# Altium project SCMLI_Snipped.PrjPCB
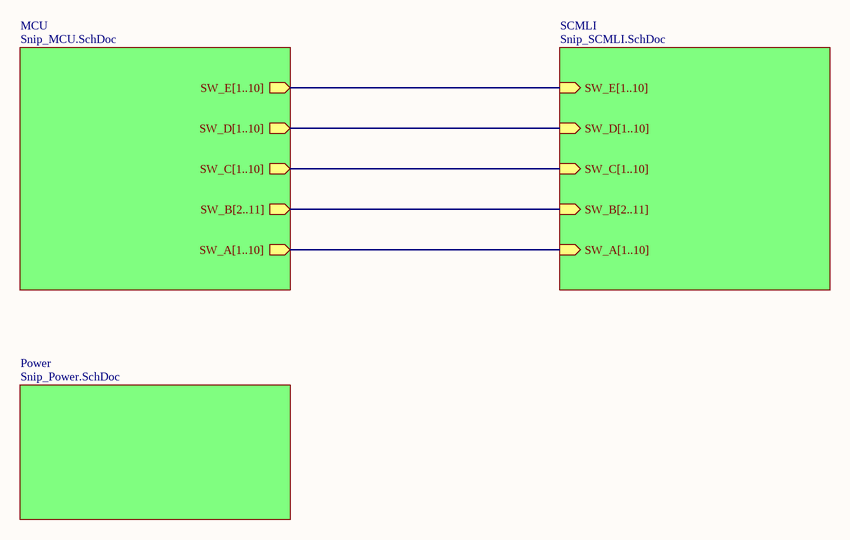
[diagram p0: Snip_Top.SchDoc]
5 sheets, 452 parts. Net scope: hierarchical (ports join the sheet entries above them; power ports are global).
Board file: SCMLI_Snipped.PcbDoc
Sheets:
  Snip_Top.SchDoc
    MCU = Snip_MCU.SchDoc
    SCMLI = Snip_SCMLI.SchDoc
      GM2 = Generic_Module.SchDoc
      GM3 = Generic_Module.SchDoc
      GM4 = Generic_Module.SchDoc
      GM5 = Generic_Module.SchDoc
      GM6 = Generic_Module.SchDoc
      GM7 = Generic_Module.SchDoc
      GM8 = Generic_Module.SchDoc
      GM9 = Generic_Module.SchDoc
      GM10 = Generic_Module.SchDoc
    Power = Snip_Power.SchDoc

## Sheet Snip_Top.SchDoc
size A

### Sub-sheets
MCU = Snip_MCU.SchDoc: SW_B[2..11] (out), SW_A[1..10] (out), SW_D[1..10] (out), SW_E[1..10] (out), SW_C[1..10] (out)
Power = Snip_Power.SchDoc: no entries
SCMLI = Snip_SCMLI.SchDoc: SW_B[2..11] (in), SW_A[1..10] (in), SW_C[1..10] (in), SW_E[1..10] (in), SW_D[1..10] (in)

### Buses and harness runs
bus sheet MCU/SW_A[1..10] = sheet SCMLI/SW_A[1..10]
bus sheet MCU/SW_B[2..11] = sheet SCMLI/SW_B[2..11]
bus sheet MCU/SW_C[1..10] = sheet SCMLI/SW_C[1..10]
bus sheet MCU/SW_D[1..10] = sheet SCMLI/SW_D[1..10]
bus sheet MCU/SW_E[1..10] = sheet SCMLI/SW_E[1..10]

## Sheet Snip_MCU.SchDoc
size C
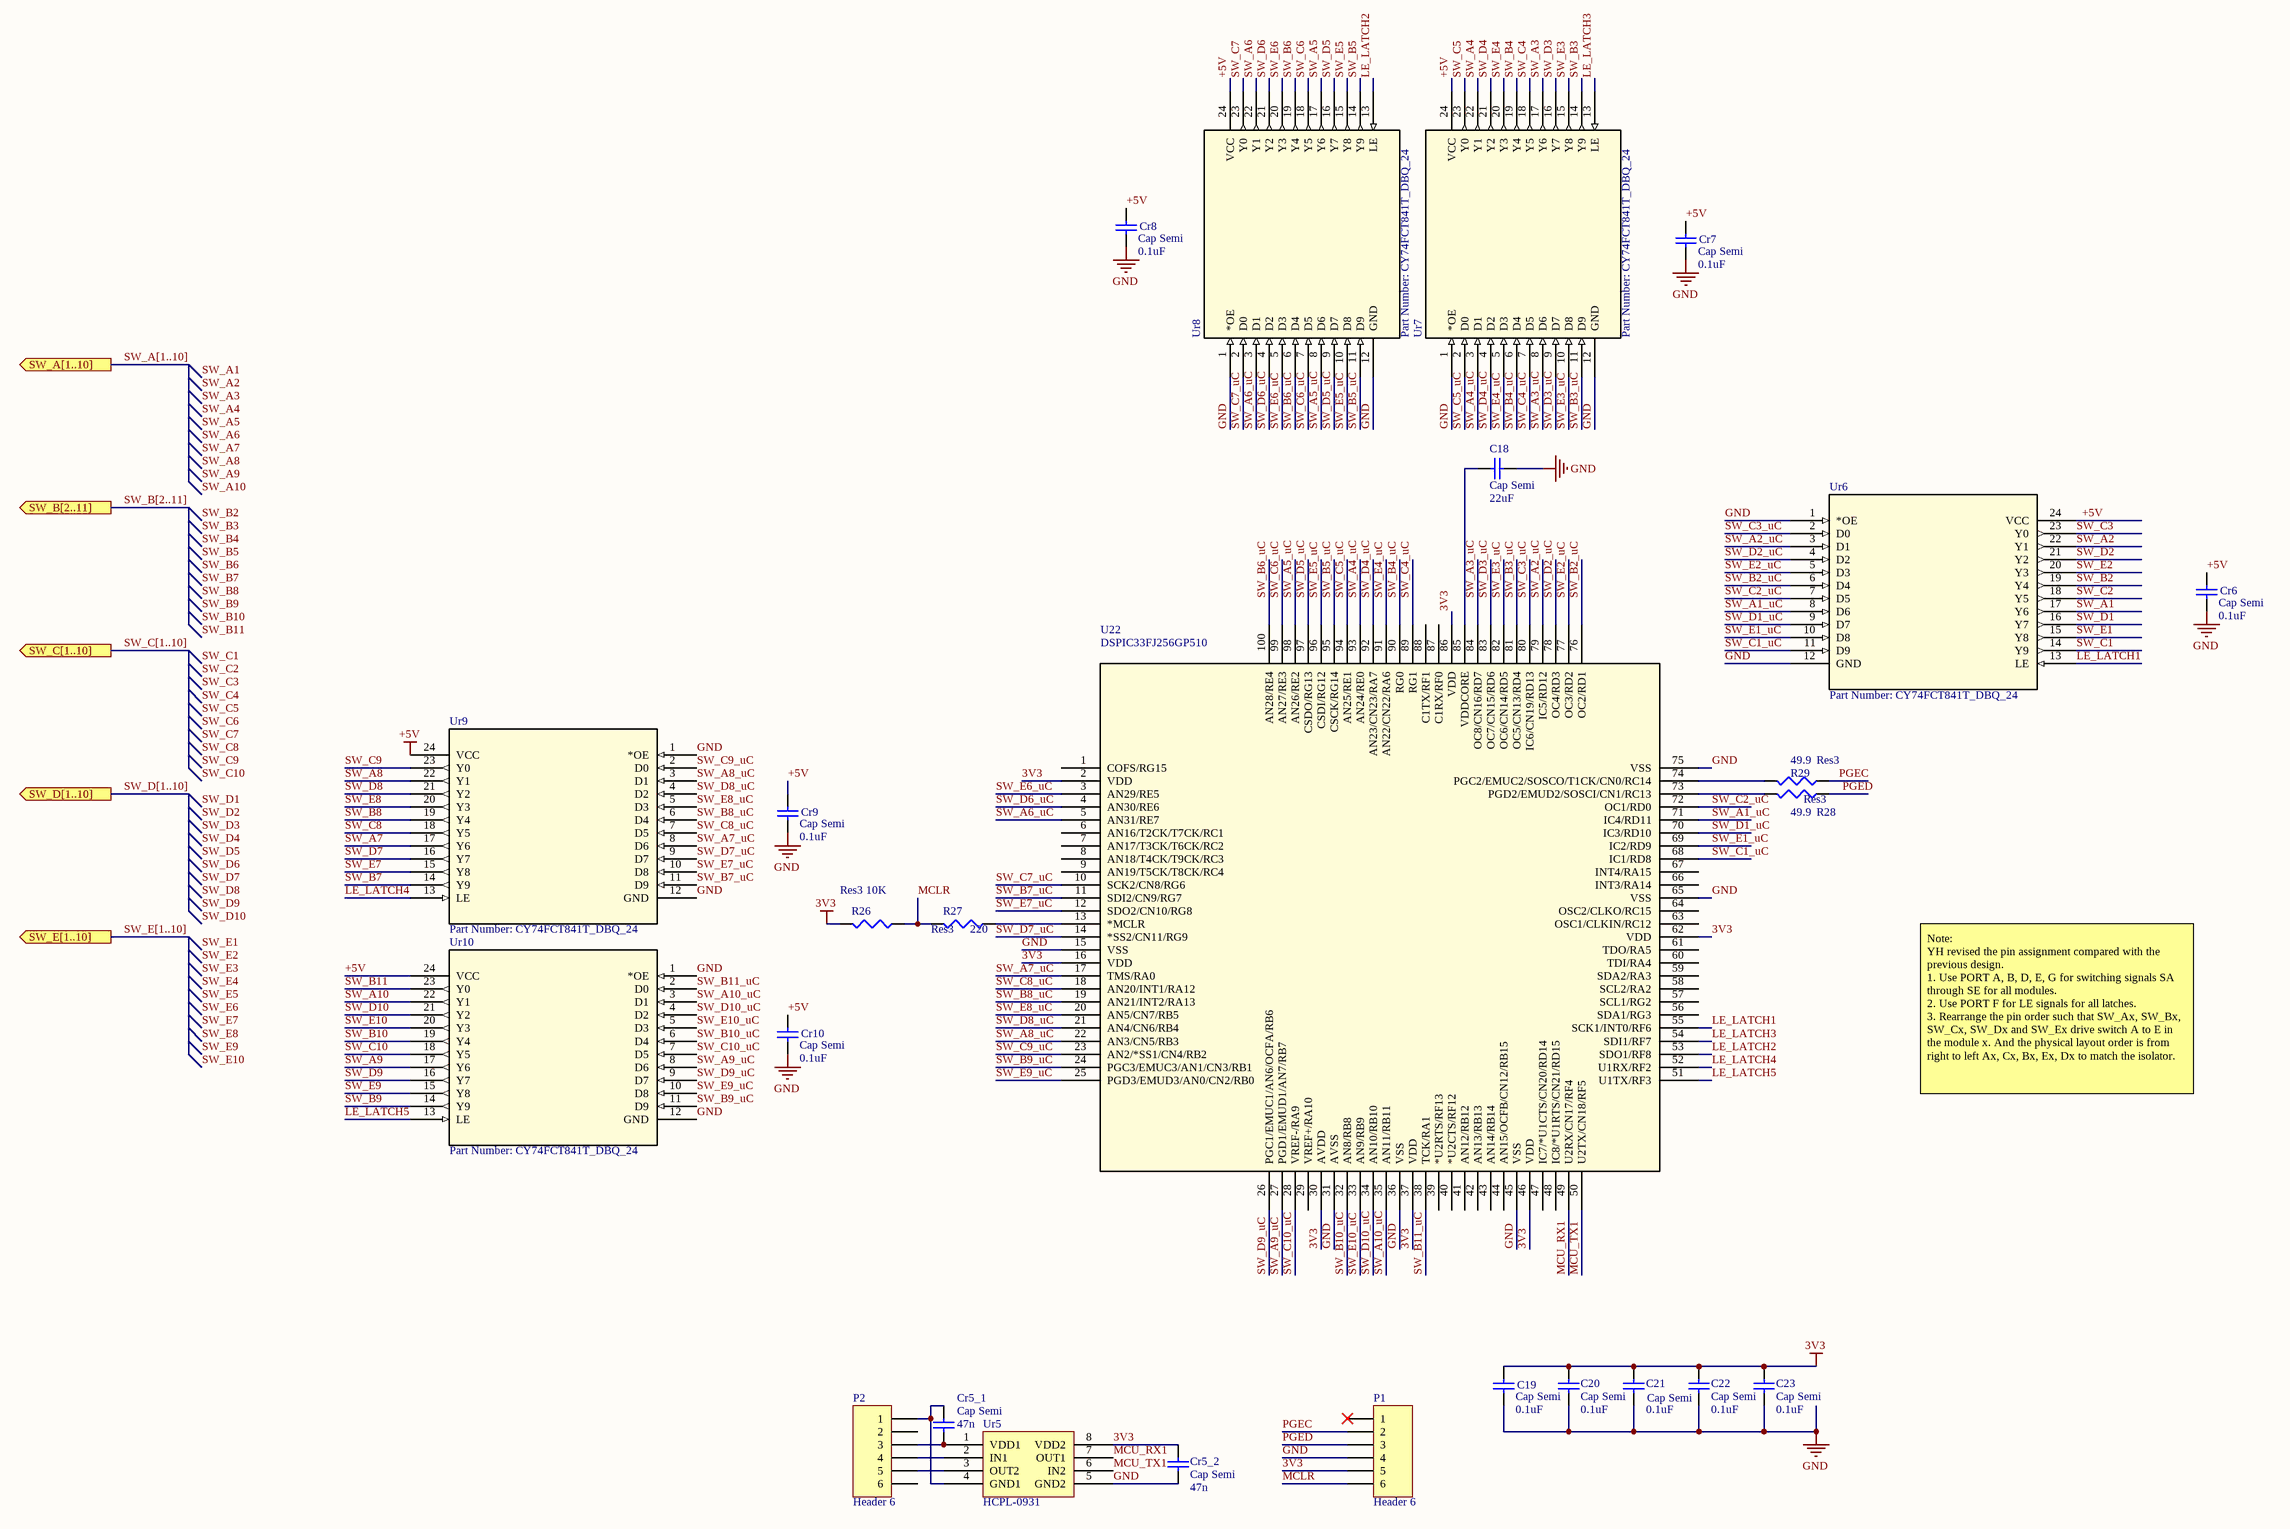
[diagram p1: Snip_MCU.SchDoc]

### Parts
C18  Cap Semi  value 22uF  [0805]
C19  Cap Semi  value 0.1uF  [1608[0603]]
C20  Cap Semi  value 0.1uF  [1608[0603]]
C21  Cap Semi  value 0.1uF  [1608[0603]]
C22  Cap Semi  value 0.1uF  [1608[0603]]
C23  Cap Semi  value 0.1uF  [1608[0603]]
Cr5_1  Cap Semi  value 47n  [C1206]
Cr5_2  Cap Semi  value 47n  [C1206]
Cr6  Cap Semi  value 0.1uF  [1608[0603]]
Cr7  Cap Semi  value 0.1uF  [1608[0603]]
Cr8  Cap Semi  value 0.1uF  [1608[0603]]
Cr9  Cap Semi  value 0.1uF  [1608[0603]]
Cr10  Cap Semi  value 0.1uF  [1608[0603]]
P1  Header 6  [HDR1X6]
P2  Header 6  [HDR1X6]
R26  Res3  value 10K  [J1-0603]
R27  Res3  value 220  [J1-0603]
R28  Res3  value 49.9  [J1-0603]
R29  Res3  value 49.9  [J1-0603]
U22  DSPIC33FJ256GP510  [TQFP100_12x12MC-]
Ur5  HCPL-0931  [SOIC-8]
Ur6  Part Number: CY74FCT841T_DBQ_24  [DBQ24]
Ur7  Part Number: CY74FCT841T_DBQ_24  [DBQ24]
Ur8  Part Number: CY74FCT841T_DBQ_24  [DBQ24]
Ur9  Part Number: CY74FCT841T_DBQ_24  [DBQ24]
Ur10  Part Number: CY74FCT841T_DBQ_24  [DBQ24]

### Ports
SW_A[1..10] (out), SW_B[2..11] (out), SW_C[1..10] (out), SW_D[1..10] (out), SW_E[1..10] (out)

### Nets
3V3: C19.2 C20.2 C21.2 C22.2 C23.2 Cr5_2.2 P1.5 R26.2 U22.2(VDD) U22.16(VDD) U22.30(AVDD) U22.37(VDD) U22.46(VDD) U22.62(VDD) U22.86(VDD) Ur5.8(VDD2)
+5V: Cr6.2 Cr7.2 Cr8.2 Cr9.2 Cr10.2 Ur6.24(VCC) Ur7.24(VCC) Ur8.24(VCC) Ur9.24(VCC) Ur10.24(VCC)
GND: C18.2 C19.1 C20.1 C21.1 C22.1 C23.1 Cr5_2.1 Cr6.1 Cr7.1 Cr8.1 Cr9.1 Cr10.1 P1.4 U22.15(VSS) U22.31(AVSS) U22.36(VSS) U22.45(VSS) U22.65(VSS) U22.75(VSS) Ur5.5(GND2) Ur6.1(*OE) Ur6.12(GND) Ur7.1(*OE) Ur7.12(GND) Ur8.1(*OE) Ur8.12(GND) Ur9.1(*OE) Ur9.12(GND) Ur10.1(*OE) Ur10.12(GND)
LE_LATCH1: U22.55(SCK1/INT0/RF6) Ur6.13(LE)
LE_LATCH2: U22.53(SDO1/RF8) Ur8.13(LE)
LE_LATCH3: U22.54(SDI1/RF7) Ur7.13(LE)
LE_LATCH4: U22.52(U1RX/RF2) Ur9.13(LE)
LE_LATCH5: U22.51(U1TX/RF3) Ur10.13(LE)
MCLR: P1.6 R26.1 R27.2
MCU_RX1: U22.49(U2RX/CN17/RF4) Ur5.7(OUT1)
MCU_TX1: U22.50(U2TX/CN18/RF5) Ur5.6(IN2)
PGEC: P1.2 R29.1
PGED: P1.3 R28.1
SW_A1: Ur6.17(Y6)
SW_A1_uC: U22.71(IC4/RD11) Ur6.8(D6)
SW_A2: Ur6.22(Y1)  [project net SW_A]
SW_A2_uC: U22.79(IC5/RD12) Ur6.3(D1)
SW_A3: Ur7.17(Y6)  [project net SW_A]
SW_A3_uC: U22.84(OC8/CN16/RD7) Ur7.8(D6)
SW_A4: Ur7.22(Y1)  [project net SW_A]
SW_A4_uC: U22.93(AN24/RE0) Ur7.3(D1)
SW_A5: Ur8.17(Y6)  [project net SW_A]
SW_A5_uC: U22.98(AN26/RE2) Ur8.8(D6)
SW_A6: Ur8.22(Y1)  [project net SW_A]
SW_A6_uC: U22.5(AN31/RE7) Ur8.3(D1)
SW_A7: Ur9.17(Y6)  [project net SW_A]
SW_A7_uC: U22.17(TMS/RA0) Ur9.8(D6)
SW_A8: Ur9.22(Y1)  [project net SW_A]
SW_A8_uC: U22.22(AN3/CN5/RB3) Ur9.3(D1)
SW_A9: Ur10.17(Y6)  [project net SW_A]
SW_A9_uC: U22.27(PGD1/EMUD1/AN7/RB7) Ur10.8(D6)
SW_A10: Ur10.22(Y1)  [project net SW_A]
SW_A10_uC: U22.35(AN11/RB11) Ur10.3(D1)
SW_B2: Ur6.19(Y4)  [project net SW_B]
SW_B2_uC: U22.76(OC2/RD1) Ur6.6(D4)
SW_B3: Ur7.14(Y9)  [project net SW_B]
SW_B3_uC: U22.81(OC5/CN13/RD4) Ur7.11(D9)
SW_B4: Ur7.19(Y4)  [project net SW_B]
SW_B4_uC: U22.90(RG0) Ur7.6(D4)
SW_B5: Ur8.14(Y9)  [project net SW_B]
SW_B5_uC: U22.95(CSCK/RG14) Ur8.11(D9)
SW_B6: Ur8.19(Y4)  [project net SW_B]
SW_B6_uC: U22.100(AN28/RE4) Ur8.6(D4)
SW_B7: Ur9.14(Y9)  [project net SW_B]
SW_B7_uC: U22.11(SDI2/CN9/RG7) Ur9.11(D9)
SW_B8: Ur9.19(Y4)  [project net SW_B]
SW_B8_uC: U22.19(AN21/INT2/RA13) Ur9.6(D4)
SW_B9: Ur10.14(Y9)  [project net SW_B]
SW_B9_uC: U22.24(PGC3/EMUC3/AN1/CN3/RB1) Ur10.11(D9)
SW_B10: Ur10.19(Y4)  [project net SW_B]
SW_B10_uC: U22.32(AN8/RB8) Ur10.6(D4)
SW_B11: Ur10.23(Y0)
SW_B11_uC: U22.38(TCK/RA1) Ur10.2(D0)
SW_C1: Ur6.14(Y9)
SW_C1_uC: U22.68(IC1/RD8) Ur6.11(D9)
SW_C2: Ur6.18(Y5)  [project net SW_C]
SW_C2_uC: U22.72(OC1/RD0) Ur6.7(D5)
SW_C3: Ur6.23(Y0)  [project net SW_C]
SW_C3_uC: U22.80(IC6/CN19/RD13) Ur6.2(D0)
SW_C4: Ur7.18(Y5)  [project net SW_C]
SW_C4_uC: U22.89(RG1) Ur7.7(D5)
SW_C5: Ur7.23(Y0)  [project net SW_C]
SW_C5_uC: U22.94(AN25/RE1) Ur7.2(D0)
SW_C6: Ur8.18(Y5)  [project net SW_C]
SW_C6_uC: U22.99(AN27/RE3) Ur8.7(D5)
SW_C7: Ur8.23(Y0)  [project net SW_C]
SW_C7_uC: U22.10(SCK2/CN8/RG6) Ur8.2(D0)
SW_C8: Ur9.18(Y5)  [project net SW_C]
SW_C8_uC: U22.18(AN20/INT1/RA12) Ur9.7(D5)
SW_C9: Ur9.23(Y0)  [project net SW_C]
SW_C9_uC: U22.23(AN2/*SS1/CN4/RB2) Ur9.2(D0)
SW_C10: Ur10.18(Y5)  [project net SW_C]
SW_C10_uC: U22.28(VREF-/RA9) Ur10.7(D5)
SW_D1: Ur6.16(Y7)
SW_D1_uC: U22.70(IC3/RD10) Ur6.9(D7)
SW_D2: Ur6.21(Y2)  [project net SW_D]
SW_D2_uC: U22.78(OC4/RD3) Ur6.4(D2)
SW_D3: Ur7.16(Y7)  [project net SW_D]
SW_D3_uC: U22.83(OC7/CN15/RD6) Ur7.9(D7)
SW_D4: Ur7.21(Y2)  [project net SW_D]
SW_D4_uC: U22.92(AN23/CN23/RA7) Ur7.4(D2)
SW_D5: Ur8.16(Y7)  [project net SW_D]
SW_D5_uC: U22.97(CSDO/RG13) Ur8.9(D7)
SW_D6: Ur8.21(Y2)  [project net SW_D]
SW_D6_uC: U22.4(AN30/RE6) Ur8.4(D2)
SW_D7: Ur9.16(Y7)  [project net SW_D]
SW_D7_uC: U22.14(*SS2/CN11/RG9) Ur9.9(D7)
SW_D8: Ur9.21(Y2)  [project net SW_D]
SW_D8_uC: U22.21(AN4/CN6/RB4) Ur9.4(D2)
SW_D9: Ur10.16(Y7)  [project net SW_D]
SW_D9_uC: U22.26(PGC1/EMUC1/AN6/OCFA/RB6) Ur10.9(D7)
SW_D10: Ur10.21(Y2)  [project net SW_D]
SW_D10_uC: U22.34(AN10/RB10) Ur10.4(D2)
SW_E1: Ur6.15(Y8)
SW_E1_uC: U22.69(IC2/RD9) Ur6.10(D8)
SW_E2: Ur6.20(Y3)  [project net SW_E]
SW_E2_uC: U22.77(OC3/RD2) Ur6.5(D3)
SW_E3: Ur7.15(Y8)  [project net SW_E]
SW_E3_uC: U22.82(OC6/CN14/RD5) Ur7.10(D8)
SW_E4: Ur7.20(Y3)  [project net SW_E]
SW_E4_uC: U22.91(AN22/CN22/RA6) Ur7.5(D3)
SW_E5: Ur8.15(Y8)  [project net SW_E]
SW_E5_uC: U22.96(CSDI/RG12) Ur8.10(D8)
SW_E6: Ur8.20(Y3)  [project net SW_E]
SW_E6_uC: U22.3(AN29/RE5) Ur8.5(D3)
SW_E7: Ur9.15(Y8)  [project net SW_E]
SW_E7_uC: U22.12(SDO2/CN10/RG8) Ur9.10(D8)
SW_E8: Ur9.20(Y3)  [project net SW_E]
SW_E8_uC: U22.20(AN5/CN7/RB5) Ur9.5(D3)
SW_E9: Ur10.15(Y8)  [project net SW_E]
SW_E9_uC: U22.25(PGD3/EMUD3/AN0/CN2/RB0) Ur10.10(D8)
SW_E10: Ur10.20(Y3)  [project net SW_E]
SW_E10_uC: U22.33(AN9/RB9) Ur10.5(D3)
NetC18_1: C18.1 U22.85(VDDCORE)
NetCr5_1_1: Cr5_1.1 P2.3 Ur5.1(VDD1)
NetCr5_1_2: Cr5_1.2 P2.1 Ur5.4(GND1)
NetP2_4: P2.4 Ur5.2(IN1)
NetP2_5: P2.5 Ur5.3(OUT2)
NetR27_1: R27.1 U22.13(*MCLR)
NetR28_2: R28.2 U22.73(PGD2/EMUD2/SOSCI/CN1/RC13)
NetR29_2: R29.2 U22.74(PGC2/EMUC2/SOSCO/T1CK/CN0/RC14)

Not connected (* = marked no-connect by the designer): P1 1*; P2 2 6; U22 1(COFS/RG15) 6(AN16/T2CK/T7CK/RC1) 7(AN17/T3CK/T6CK/RC2) 8(AN18/T4CK/T9CK/RC3) 9(AN19/T5CK/T8CK/RC4) 29(VREF+/RA10) 39(*U2RTS/RF13) 40(*U2CTS/RF12) 41(AN12/RB12) 42(AN13/RB13) 43(AN14/RB14) 44(AN15/OCFB/CN12/RB15) 47(IC7/*U1CTS/CN20/RD14) 48(IC8/*U1RTS/CN21/RD15) 56(SDA1/RG3) 57(SCL1/RG2) 58(SCL2/RA2) 59(SDA2/RA3) 60(TDI/RA4) 61(TDO/RA5) 63(OSC1/CLKIN/RC12) 64(OSC2/CLKO/RC15) 66(INT3/RA14) 67(INT4/RA15) 87(C1RX/RF0) 88(C1TX/RF1)

### Buses and harness runs
bus SW_A[1..10] = port SW_A[1..10]
bus SW_B[2..11] = port SW_B[2..11]
bus SW_C[1..10] = port SW_C[1..10]
bus SW_D[1..10] = port SW_D[1..10]
bus SW_E[1..10] = port SW_E[1..10]

### Notes on the sheet
- Note:
  YH revised the pin assignment compared with the previous design.
  1. Use PORT A, B, D, E, G for switching signals SA through SE for all modules.
  2. Use PORT F for LE signals for all latches.
  3. Rearrange the pin order such that SW_Ax, SW_Bx, SW_Cx, SW_Dx and SW_Ex drive switch A to E in the module x. And the physical layout order is from right to left Ax, Cx, Bx, Ex, Dx to match the isolator.
- Labels drawn without touching a wire or pin: SW_A1, SW_A2, SW_A3, SW_A4, SW_A5, SW_A6, SW_A7, SW_A8, SW_A9, SW_A10, SW_B2, SW_B3, SW_B4, SW_B5, SW_B6, SW_B7, SW_B8, SW_B9, SW_B10, SW_B11, SW_C1, SW_C2, SW_C3, SW_C4, SW_C5, SW_C6, SW_C7, SW_C8, SW_C9, SW_C10, SW_D1, SW_D2, SW_D3, SW_D4, SW_D5, SW_D6, SW_D7, SW_D8, SW_D9, SW_D10, SW_E1, SW_E2, SW_E3, SW_E4, SW_E5, SW_E6, SW_E7, SW_E8, SW_E9, SW_E10

### Library data of the parts
C18-C23 Cr5_1 Cr5_2 Cr6-Cr10 = Cap Semi: Capacitor (Semiconductor SIM Model); Published: 8-Jun-2000; LatestRevisionDate: 29-May-2009; LatestRevisionNote: IPC-7351 Footprint Added.; PackageReference: C1206; Publisher: Altium Limited; PackageDescription: Chip Capacitor
P1 P2 = Header 6: Header, 6-Pin; LatestRevisionDate: 17-Jul-2002; LatestRevisionNote: Re-released for DXP Platform.; Publisher: Altium Limited
R26-R29 = Res3: Resistor; Published: 8-Jun-2000; LatestRevisionDate: 29-May-2009; LatestRevisionNote: IPC-7351 Footprint Added.; PackageReference: J1-0603; Publisher: Altium Limited; PackageDescription: Chip Resistor
U22 = DSPIC33FJ256GP510: No Description Available; Copyright: Copyright (C) 2018 Accelerated Designs. All rights reserved; RefDes: RefDes; Type: DEV; Value: Value
Ur6-Ur10 = CY74FCT841T_DBQ_: 10-Bit Bus-Interface D-Type Latches with 3-State Outputs; Manufacturer: Texas Instruments; INDUSTRY_STD_PKG_TYPE: SSOP/QSOP; PIN_COUNT: 24; PACKAGE_DESIGNATOR: DBQ; Datasheet_URL: http://www.ti.com/lit/gpn/CY74FCT841T; FAMILY_NAME: D-TYPE LATCH; GENERIC_PART_NUMBER: CY74FCT841T; Vendor: Texas Instruments; Manufacturer_Part_Number: CY74FCT841T_DBQ_24; Copyright: Copyright (C) 2018 Accelerated Designs. All rights reserved; RefDes: RefDes; Type: DEV; Value: Value
Ur5 = HCPL-0931: ComponentLink: http://www.digikey.com/product-detail/en/broadcom-limited/HCPL-0931/516-2702-5-ND/969355

## Sheet Snip_SCMLI.SchDoc
size D
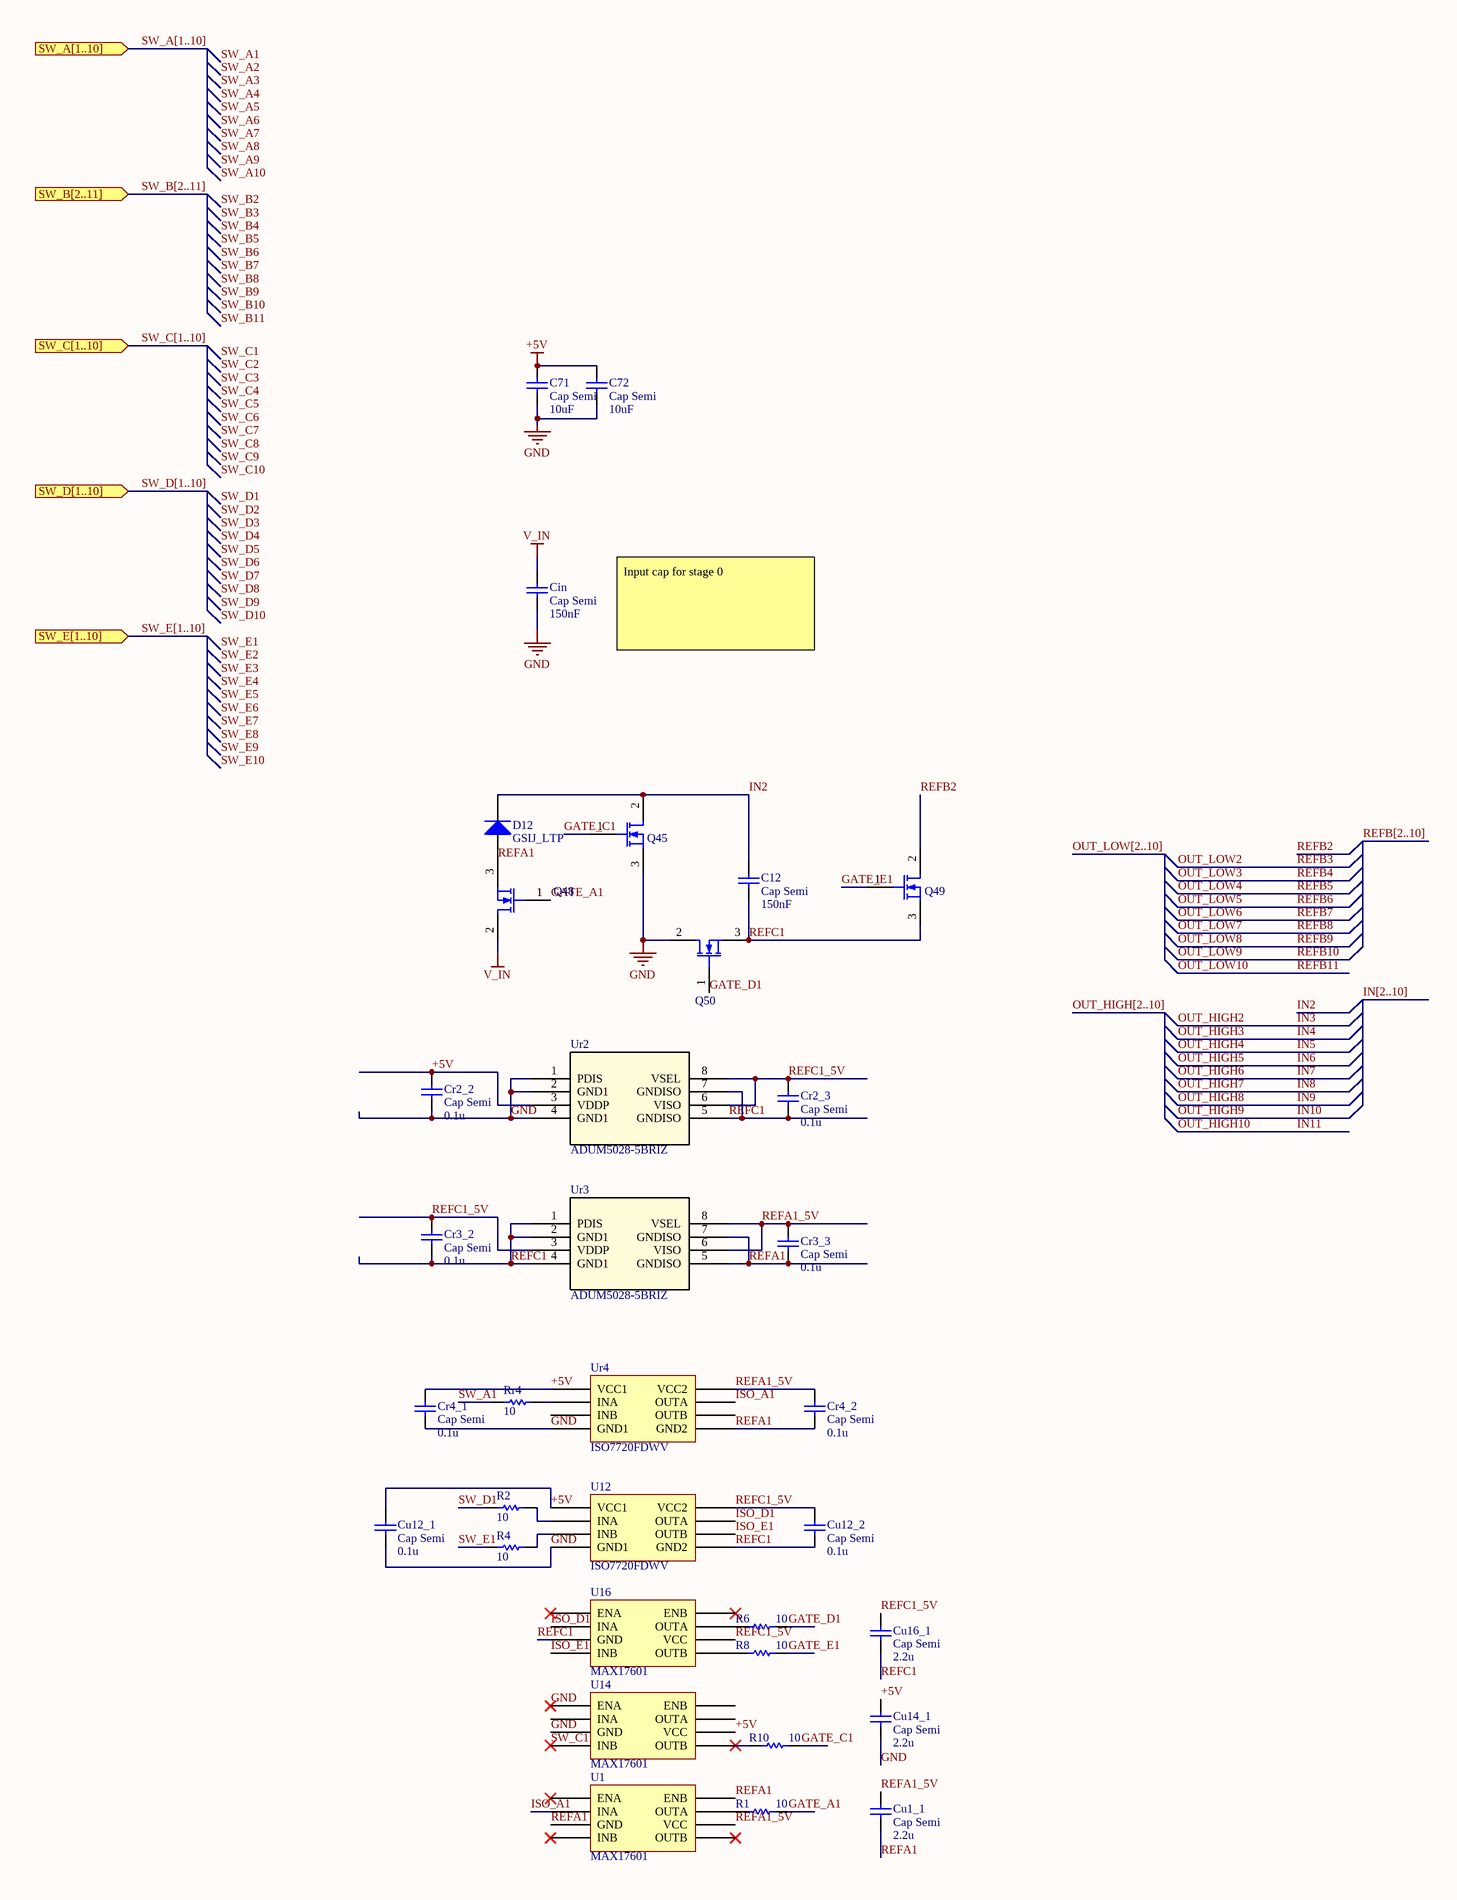
[diagram p2: Snip_SCMLI.SchDoc, left]
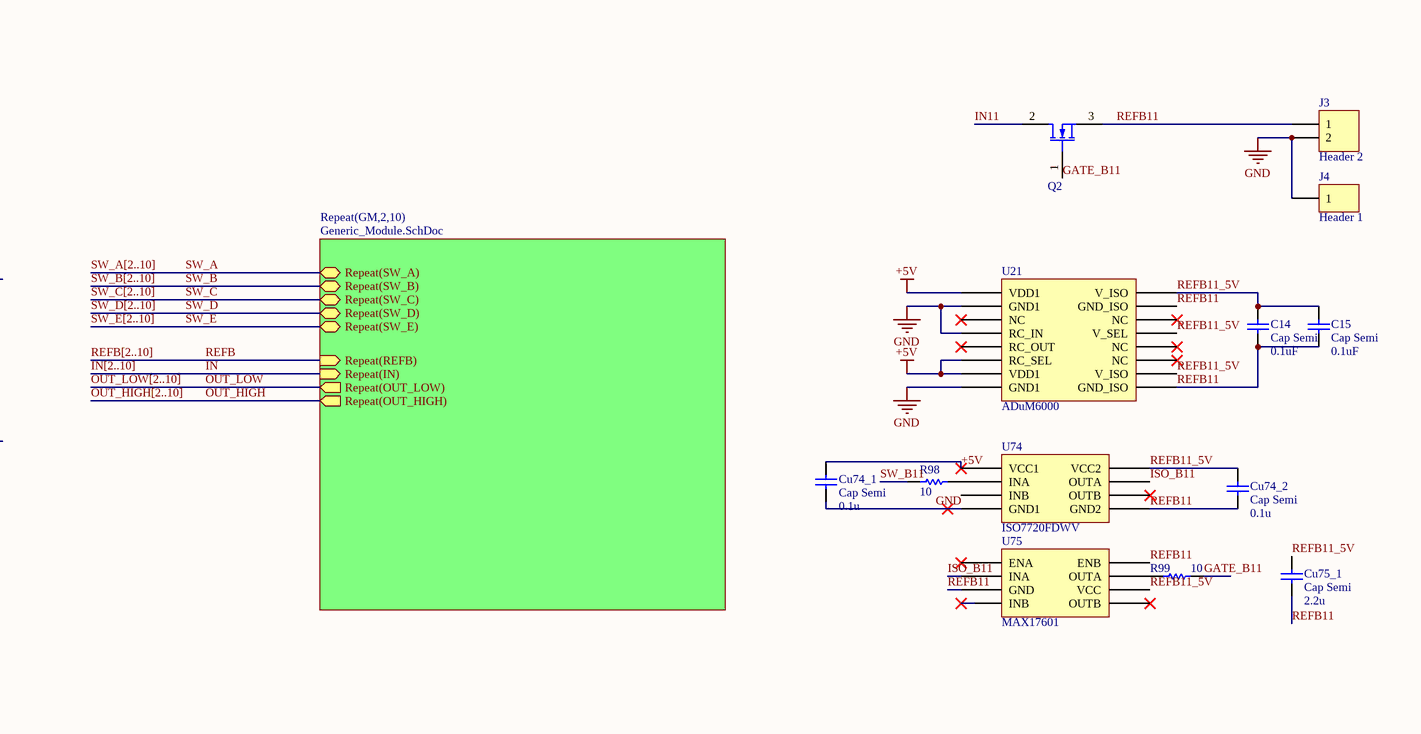
[diagram p3: Snip_SCMLI.SchDoc, right]

### Parts
C12  Cap Semi  value 150nF  [1812]
C14  Cap Semi  value 0.1uF  [J1-0603]
C15  Cap Semi  value 0.1uF  [J1-0603]
C71  Cap Semi  value 10uF  [1608[0603]]
C72  Cap Semi  value 10uF  [1608[0603]]
Cin  Cap Semi  value 150nF  [1812]
Cr2_2  Cap Semi  value 0.1u  [1608[0603]]
Cr2_3  Cap Semi  value 0.1u  [J1-0603]
Cr3_2  Cap Semi  value 0.1u  [1608[0603]]
Cr3_3  Cap Semi  value 0.1u  [1608[0603]]
Cr4_1  Cap Semi  value 0.1u  [C1206]
Cr4_2  Cap Semi  value 0.1u  [C1206]
Cu1_1  Cap Semi  value 2.2u  [1608[0603]]
Cu12_1  Cap Semi  value 0.1u  [C1206]
Cu12_2  Cap Semi  value 0.1u  [C1206]
Cu14_1  Cap Semi  value 2.2u  [1608[0603]]
Cu16_1  Cap Semi  value 2.2u  [1608[0603]]
Cu74_1  Cap Semi  value 0.1u  [C1206]
Cu74_2  Cap Semi  value 0.1u  [C1206]
Cu75_1  Cap Semi  value 2.2u  [1608[0603]]
D12  GSIJ_LTP  [SE30PAJ-M3]
J3  Header 2  [HVOUT]
J4  Header 1  [GNDOUT]
Q2  IPN80R1K2P7  [SOT233-3]  (value not drawn)
Q45  IPN80R1K2P7  [SOT233-3]  (value not drawn)
Q48  IPN80R1K2P7  [SOT233-3]  (value not drawn)
Q49  IPN80R1K2P7  [SOT233-3]  (value not drawn)
Q50  IPN80R1K2P7  [SOT233-3]  (value not drawn)
R1  10  [1608[0603]]
R2  10  [1608[0603]]
R4  10  [1608[0603]]
R6  10  [1608[0603]]
R8  10  [1608[0603]]
R10  10  [1608[0603]]
R98  10  [1608[0603]]
R99  10  [1608[0603]]
Rr4  10  [1608[0603]]
U1  MAX17601  [DFN-8_DD]
U12  ISO7720FDWV  [TI_DWV]
U14  MAX17601  [DFN-8_DD]
U16  MAX17601  [DFN-8_DD]
U21  ADuM6000  [SOIC127P1030X265-16N]
U74  ISO7720FDWV  [TI_DWV]
U75  MAX17601  [DFN-8_DD]
Ur2  ADUM5028-5BRIZ  [RI_8_1]
Ur3  ADUM5028-5BRIZ  [RI_8_1]
Ur4  ISO7720FDWV  [TI_DWV]

### Sub-sheets
Repeat(GM,2,10) = Generic_Module.SchDoc: Repeat(SW_A) (bidir), Repeat(SW_B) (bidir), Repeat(SW_C) (bidir), Repeat(SW_D) (bidir), Repeat(SW_E) (bidir), Repeat(REFB) (in), Repeat(IN) (in), Repeat(OUT_LOW) (out), Repeat(OUT_HIGH) (out)

### Ports
SW_A[1..10] (in), SW_B[2..11] (in), SW_C[1..10] (in), SW_D[1..10] (in), SW_E[1..10] (in)

### Nets
+5V: C71.2 C72.2 Cr2_2.2 Cr4_1.2 Cu12_1.2 Cu14_1.2 Cu74_1.2 U12.1(VCC1) U14.6(VCC) U21.1(VDD1) U21.6(RC_SEL) U21.7(VDD1) U74.1(VCC1) Ur2.3(VDDP) Ur4.1(VCC1)
GND: C71.1 C72.1 Cin.1 Cr2_2.1 Cr4_1.1 Cu12_1.1 Cu14_1.1 Cu74_1.1 J3.2 J4.1 Q45.3 Q50.2 U12.4(GND1) U14.1(ENA) U14.3(GND) U21.2(GND1) U21.4(RC_IN) U21.8(GND1) U74.4(GND1) Ur2.1(PDIS) Ur2.2(GND1) Ur2.4(GND1) Ur4.4(GND1)
V_IN: Cin.2 Q48.2
GATE_A1: Q48.1 R1.2
GATE_B11: Q2.1 R99.2
GATE_C1: Q45.1 R10.2
GATE_D1: Q50.1 R6.2
GATE_E1: Q49.1 R8.2
IN: sheet Repeat(GM,2,10)/Repeat(IN)
IN2: C12.2 D12.2(K) Q45.2  [project net IN]
IN11: Q2.2  [also labelled OUT_HIGH10]
ISO_A1: U1.2(INA) Ur4.7(OUTA)
ISO_B11: U74.7(OUTA) U75.2(INA)
ISO_D1: U12.7(OUTA) U16.2(INA)
ISO_E1: U12.6(OUTB) U16.4(INB)
OUT_HIGH: sheet Repeat(GM,2,10)/Repeat(OUT_HIGH)
OUT_LOW: sheet Repeat(GM,2,10)/Repeat(OUT_LOW)
OUT_LOW10: C14.1 C15.1 Cu74_2.1 Cu75_1.1 J3.1 Q2.3 U21.9(GND_ISO) U21.15(GND_ISO) U74.5(GND2) U75.3(GND) U75.8(ENB)  [also labelled REFB11]  [project net OUT_LOW]
REFA1: Cr3_3.1 Cr4_2.1 Cu1_1.1 D12.1(A) Q48.3 U1.3(GND) U1.8(ENB) Ur3.5(GNDISO) Ur3.7(GNDISO) Ur4.5(GND2)
REFA1_5V: Cr3_3.2 Cr4_2.2 Cu1_1.2 U1.6(VCC) Ur3.6(VISO) Ur3.8(VSEL) Ur4.8(VCC2)
REFB: sheet Repeat(GM,2,10)/Repeat(REFB)
REFB2: Q49.2  [project net REFB]
REFB11_5V: C14.2 C15.2 Cu74_2.2 Cu75_1.2 U21.10(V_ISO) U21.13(V_SEL) U21.16(V_ISO) U74.8(VCC2) U75.6(VCC)
REFC1: C12.1 Cr2_3.1 Cr3_2.1 Cu12_2.1 Cu16_1.1 Q49.3 Q50.3 U12.5(GND2) U16.3(GND) Ur2.5(GNDISO) Ur2.7(GNDISO) Ur3.1(PDIS) Ur3.2(GND1) Ur3.4(GND1)
REFC1_5V: Cr2_3.2 Cr3_2.2 Cu12_2.2 Cu16_1.2 U12.8(VCC2) U16.6(VCC) Ur2.6(VISO) Ur2.8(VSEL) Ur3.3(VDDP)
SW_A: sheet Repeat(GM,2,10)/Repeat(SW_A)
SW_A1: Rr4.2
SW_B: sheet Repeat(GM,2,10)/Repeat(SW_B)
SW_B11: R98.2
SW_C: sheet Repeat(GM,2,10)/Repeat(SW_C)
SW_C1: U14.4(INB)
SW_D: sheet Repeat(GM,2,10)/Repeat(SW_D)
SW_D1: R2.2
SW_E: sheet Repeat(GM,2,10)/Repeat(SW_E)
SW_E1: R4.2
NetR1_1: R1.1 U1.7(OUTA)
NetR2_1: R2.1 U12.2(INA)
NetR4_1: R4.1 U12.3(INB)
NetR6_1: R6.1 U16.7(OUTA)
NetR8_1: R8.1 U16.5(OUTB)
NetR10_1: R10.1 U14.5(OUTB)
NetR98_1: R98.1 U74.2(INA)
NetR99_1: R99.1 U75.7(OUTA)
NetRr4_1: Rr4.1 Ur4.2(INA)

Not connected (* = marked no-connect by the designer): U1 1(ENA)* 4(INB)* 5(OUTB)*; U14 2(INA) 7(OUTA) 8(ENB); U16 1(ENA)* 8(ENB)*; U21 3(NC)* 5(RC_OUT)* 11(NC)* 12(NC)* 14(NC)*; U74 3(INB) 6(OUTB)*; U75 1(ENA)* 4(INB)* 5(OUTB)*; Ur4 3(INB) 6(OUTB)

### Buses and harness runs
bus IN[2..10]
bus OUT_HIGH[2..10]
bus OUT_LOW[2..10]
bus REFB[2..10]
bus SW_A[1..10] = port SW_A[1..10]
bus SW_A[2..10]
bus SW_B[2..10]
bus SW_B[2..11] = port SW_B[2..11]
bus SW_C[1..10] = port SW_C[1..10]
bus SW_C[2..10]
bus SW_D[1..10] = port SW_D[1..10]
bus SW_D[2..10]
bus SW_E[1..10] = port SW_E[1..10]
bus SW_E[2..10]

### Notes on the sheet
- Input cap for stage 0
- Labels drawn without touching a wire or pin: SW_A1, SW_A2, SW_A3, SW_A4, SW_A5, SW_A6, SW_A7, SW_A8, SW_A9, SW_A10, SW_B2, SW_B3, SW_B4, SW_B5, SW_B6, SW_B7, SW_B8, SW_B9, SW_B10, SW_B11, SW_C1, SW_C2, SW_C3, SW_C4, SW_C5, SW_C6, SW_C7, SW_C8, SW_C9, SW_C10, SW_D1, SW_D2, SW_D3, SW_D4, SW_D5, SW_D6, SW_D7, SW_D8, SW_D9, SW_D10, SW_E1, SW_E2, SW_E3, SW_E4, SW_E5, SW_E6, SW_E7, SW_E8, SW_E9, SW_E10
- Title
- Size:
- Date:
- File:
- D
- Number:
- Time:
- Revision:
- Sheet
- of

### Library data of the parts
C12 C14 C15 C71 C72 Cin Cr2_2 Cr2_3 Cr3_2 Cr3_3 Cr4_1 Cr4_2 Cu1_1 Cu12_1 Cu12_2 Cu14_1 Cu16_1 Cu74_1 Cu74_2 Cu75_1 = Cap Semi: Capacitor (Semiconductor SIM Model); Published: 8-Jun-2000; LatestRevisionDate: 29-May-2009; LatestRevisionNote: IPC-7351 Footprint Added.; PackageReference: C1206; Publisher: Altium Limited; PackageDescription: Chip Capacitor
D12 = SE30PAJ-M3
J3 = Header 2: Header, 2-Pin; LatestRevisionDate: 17-Jul-2002; LatestRevisionNote: Re-released for DXP Platform.; Publisher: Altium Limited
J4 = Header 1: Header, 1-Pin; LatestRevisionDate: 17-Jul-2002; LatestRevisionNote: Re-released for DXP Platform.; Publisher: Altium Limited
R1 R2 R4 R6 R8 R10 R98 R99 Rr4 = Resistor_ST: Resistor 0402 / 0603 / 0805; Value: 10K
U21 = ADuM6000: Isolatd 5V-5V DCDC power supply
Ur2 Ur3 = ADUM5028-5BRIZ: No Description Available; Copyright: Copyright (C) 2018 Accelerated Designs. All rights reserved; RefDes: RefDes; Type: DEV; Value: Value

## Sheet Generic_Module.SchDoc
size C
Used 9 times, as channels SCMLI/GM2, SCMLI/GM3, SCMLI/GM4, SCMLI/GM5, SCMLI/GM6, SCMLI/GM7, SCMLI/GM8, SCMLI/GM9, SCMLI/GM10. Parts and nets are listed once, with the designators drawn on the sheet.
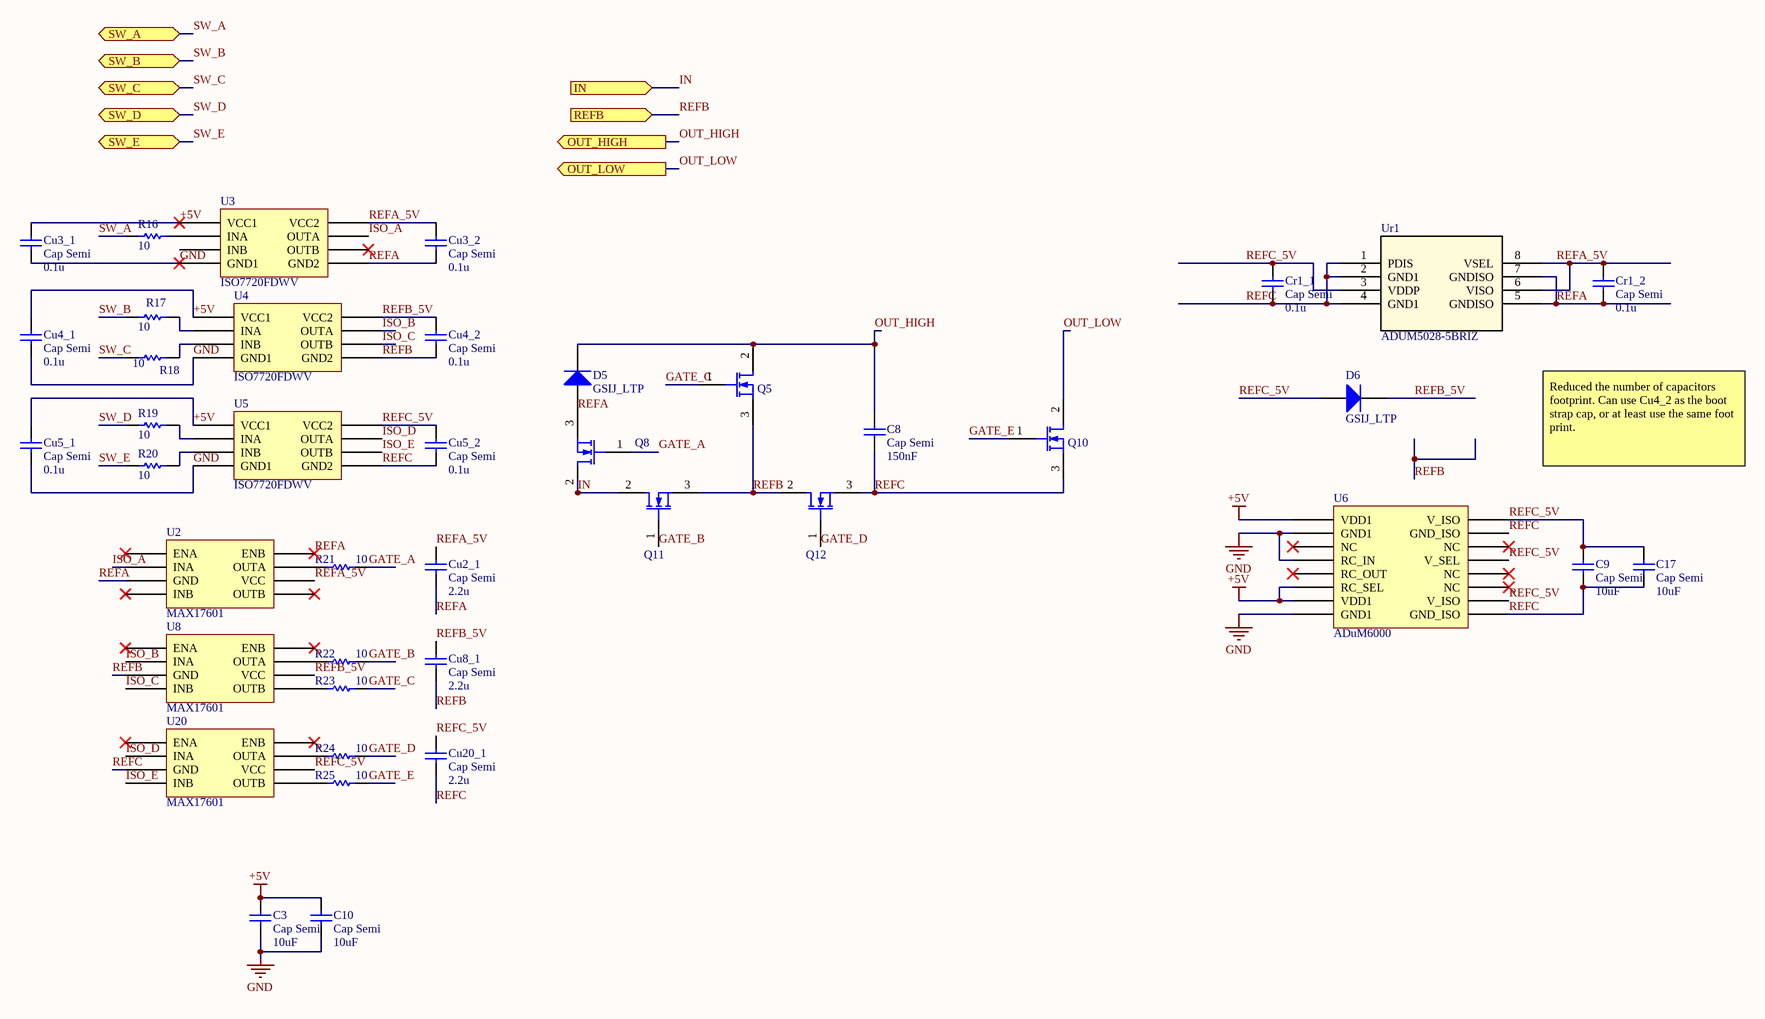
[diagram p4: Generic_Module.SchDoc]

### Parts
C3  Cap Semi  value 10uF  [1608[0603]]
C8  Cap Semi  value 150nF  [1812]
C9  Cap Semi  value 10uF  [J1-0603]
C10  Cap Semi  value 10uF  [1608[0603]]
C17  Cap Semi  value 10uF  [J1-0603]
Cr1_1  Cap Semi  value 0.1u  [J1-0603]
Cr1_2  Cap Semi  value 0.1u  [J1-0603]
Cu2_1  Cap Semi  value 2.2u  [1608[0603]]
Cu3_1  Cap Semi  value 0.1u  [C1206]
Cu3_2  Cap Semi  value 0.1u  [C1206]
Cu4_1  Cap Semi  value 0.1u  [C1206]
Cu4_2  Cap Semi  value 0.1u  [C1206]
Cu5_1  Cap Semi  value 0.1u  [C1206]
Cu5_2  Cap Semi  value 0.1u  [C1206]
Cu8_1  Cap Semi  value 2.2u  [1608[0603]]
Cu20_1  Cap Semi  value 2.2u  [1608[0603]]
D5  GSIJ_LTP  [SE30PAJ-M3]
D6  GSIJ_LTP  [SE30PAJ-M3]
Q5  IPN80R1K2P7  [SOT233-3]  (value not drawn)
Q8  IPN80R1K2P7  [SOT233-3]  (value not drawn)
Q10  IPN80R1K2P7  [SOT233-3]  (value not drawn)
Q11  IPN80R1K2P7  [SOT233-3]  (value not drawn)
Q12  IPN80R1K2P7  [SOT233-3]  (value not drawn)
R16  10  [1608[0603]]
R17  10  [1608[0603]]
R18  10  [1608[0603]]
R19  10  [1608[0603]]
R20  10  [1608[0603]]
R21  10  [1608[0603]]
R22  10  [1608[0603]]
R23  10  [1608[0603]]
R24  10  [1608[0603]]
R25  10  [1608[0603]]
U2  MAX17601  [DFN-8_DD]
U3  ISO7720FDWV  [TI_DWV]
U4  ISO7720FDWV  [TI_DWV]
U5  ISO7720FDWV  [TI_DWV]
U6  ADuM6000  [SOIC127P1030X265-16N]
U8  MAX17601  [DFN-8_DD]
U20  MAX17601  [DFN-8_DD]
Ur1  ADUM5028-5BRIZ  [RI_8_1]

### Ports
IN (in), OUT_HIGH (out), OUT_LOW (out), REFB (in), SW_A (bidir), SW_B (bidir), SW_C (bidir), SW_D (bidir), SW_E (bidir)

### Nets
+5V: C3.2 C10.2 Cu3_1.2 Cu4_1.2 Cu5_1.2 U3.1(VCC1) U4.1(VCC1) U5.1(VCC1) U6.1(VDD1) U6.6(RC_SEL) U6.7(VDD1)
GND: C3.1 C10.1 Cu3_1.1 Cu4_1.1 Cu5_1.1 U3.4(GND1) U4.4(GND1) U5.4(GND1) U6.2(GND1) U6.4(RC_IN) U6.8(GND1)
GATE_A: Q8.1 R21.2
GATE_B: Q11.1 R22.2
GATE_C: Q5.1 R23.2
GATE_D: Q12.1 R24.2
GATE_E: Q10.1 R25.2
IN: Q8.2 Q11.2 ; port IN
ISO_A: U2.2(INA) U3.7(OUTA)
ISO_B: U4.7(OUTA) U8.2(INA)
ISO_C: U4.6(OUTB) U8.4(INB)
ISO_D: U5.7(OUTA) U20.2(INA)
ISO_E: U5.6(OUTB) U20.4(INB)
OUT_HIGH: C8.2 D5.2(K) Q5.2 ; port OUT_HIGH
OUT_LOW: Q10.2 ; port OUT_LOW
REFA: Cr1_2.1 Cu2_1.1 Cu3_2.1 D5.1(A) Q8.3 U2.3(GND) U2.8(ENB) U3.5(GND2) Ur1.5(GNDISO) Ur1.7(GNDISO)
REFA_5V: Cr1_2.2 Cu2_1.2 Cu3_2.2 U2.6(VCC) U3.8(VCC2) Ur1.6(VISO) Ur1.8(VSEL)
REFB: Cu4_2.1 Cu8_1.1 Q5.3 Q11.3 Q12.2 U4.5(GND2) U8.3(GND) ; port REFB
REFB_5V: Cu4_2.2 Cu8_1.2 D6.2(K) U4.8(VCC2) U8.6(VCC)
REFC: C8.1 C9.1 C17.1 Cr1_1.1 Cu5_2.1 Cu20_1.1 Q10.3 Q12.3 U5.5(GND2) U6.9(GND_ISO) U6.15(GND_ISO) U20.3(GND) Ur1.1(PDIS) Ur1.2(GND1) Ur1.4(GND1)
REFC_5V: C9.2 C17.2 Cr1_1.2 Cu5_2.2 Cu20_1.2 D6.1(A) U5.8(VCC2) U6.10(V_ISO) U6.13(V_SEL) U6.16(V_ISO) U20.6(VCC) Ur1.3(VDDP)
SW_A: R16.2 ; port SW_A
SW_B: R17.2 ; port SW_B
SW_C: R18.1 ; port SW_C
SW_D: R19.2 ; port SW_D
SW_E: R20.2 ; port SW_E
NetR16_1: R16.1 U3.2(INA)
NetR17_1: R17.1 U4.2(INA)
NetR18_2: R18.2 U4.3(INB)
NetR19_1: R19.1 U5.2(INA)
NetR20_1: R20.1 U5.3(INB)
NetR21_1: R21.1 U2.7(OUTA)
NetR22_1: R22.1 U8.7(OUTA)
NetR23_1: R23.1 U8.5(OUTB)
NetR24_1: R24.1 U20.7(OUTA)
NetR25_1: R25.1 U20.5(OUTB)

Not connected (* = marked no-connect by the designer): U2 1(ENA)* 4(INB)* 5(OUTB)*; U3 3(INB) 6(OUTB)*; U6 3(NC)* 5(RC_OUT)* 11(NC)* 12(NC)* 14(NC)*; U8 1(ENA)* 8(ENB)*; U20 1(ENA)* 8(ENB)*

### Channels
SCMLI/GM2: designators end in _GM2; ports IN=IN OUT_HIGH=IN OUT_LOW=OUT_LOW REFB=REFB SW_A=SW_A SW_B=SW_B SW_C=SW_C SW_D=SW_D SW_E=SW_E
SCMLI/GM3: designators end in _GM3; ports IN=IN OUT_HIGH=IN OUT_LOW=OUT_LOW REFB=OUT_LOW SW_A=SW_A SW_B=SW_B SW_C=SW_C SW_D=SW_D SW_E=SW_E
SCMLI/GM4: designators end in _GM4; ports IN=IN OUT_HIGH=IN OUT_LOW=OUT_LOW REFB=OUT_LOW SW_A=SW_A SW_B=SW_B SW_C=SW_C SW_D=SW_D SW_E=SW_E
SCMLI/GM5: designators end in _GM5; ports IN=IN OUT_HIGH=IN OUT_LOW=OUT_LOW REFB=OUT_LOW SW_A=SW_A SW_B=SW_B SW_C=SW_C SW_D=SW_D SW_E=SW_E
SCMLI/GM6: designators end in _GM6; ports IN=IN OUT_HIGH=IN OUT_LOW=OUT_LOW REFB=OUT_LOW SW_A=SW_A SW_B=SW_B SW_C=SW_C SW_D=SW_D SW_E=SW_E
SCMLI/GM7: designators end in _GM7; ports IN=IN OUT_HIGH=IN OUT_LOW=OUT_LOW REFB=OUT_LOW SW_A=SW_A SW_B=SW_B SW_C=SW_C SW_D=SW_D SW_E=SW_E
SCMLI/GM8: designators end in _GM8; ports IN=IN OUT_HIGH=IN OUT_LOW=OUT_LOW REFB=OUT_LOW SW_A=SW_A SW_B=SW_B SW_C=SW_C SW_D=SW_D SW_E=SW_E
SCMLI/GM9: designators end in _GM9; ports IN=IN OUT_HIGH=IN OUT_LOW=OUT_LOW REFB=OUT_LOW SW_A=SW_A SW_B=SW_B SW_C=SW_C SW_D=SW_D SW_E=SW_E
SCMLI/GM10: designators end in _GM10; ports IN=IN OUT_HIGH=IN11 OUT_LOW=OUT_LOW REFB=OUT_LOW SW_A=SW_A SW_B=SW_B SW_C=SW_C SW_D=SW_D SW_E=SW_E

### Notes on the sheet
- Reduced the number of capacitors footprint. Can use Cu4_2 as the boot strap cap, or at least use the same foot print.
- Title
- Size:
- Date:
- File:
- C
- Number:
- Time:
- Revision:
- Sheet
- of

### Library data of the parts
C3 C8-C10 C17 Cr1_1 Cr1_2 Cu2_1 Cu3_1 Cu3_2 Cu4_1 Cu4_2 Cu5_1 Cu5_2 Cu8_1 Cu20_1 = Cap Semi: Capacitor (Semiconductor SIM Model); Published: 8-Jun-2000; LatestRevisionDate: 29-May-2009; LatestRevisionNote: IPC-7351 Footprint Added.; PackageReference: C1206; Publisher: Altium Limited; PackageDescription: Chip Capacitor
D5 D6 = SE30PAJ-M3
R16-R25 = Resistor_ST: Resistor 0402 / 0603 / 0805; Value: 10K
U6 = ADuM6000: Isolatd 5V-5V DCDC power supply
Ur1 = ADUM5028-5BRIZ: No Description Available; Copyright: Copyright (C) 2018 Accelerated Designs. All rights reserved; RefDes: RefDes; Type: DEV; Value: Value

## Sheet Snip_Power.SchDoc
size A
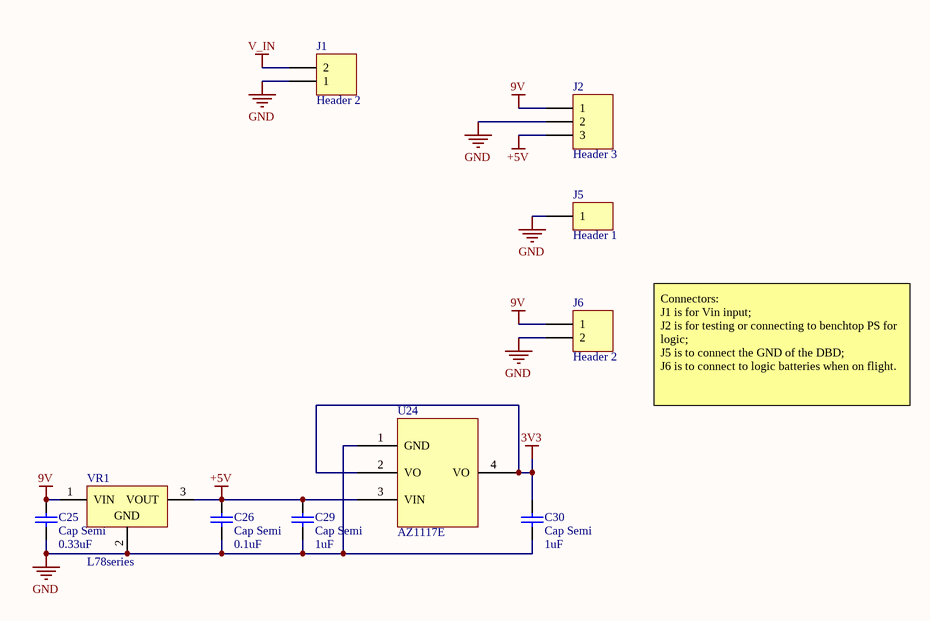
[diagram p5: Snip_Power.SchDoc]

### Parts
C25  Cap Semi  value 0.33uF  [C1206]
C26  Cap Semi  value 0.1uF  [C1206]
C29  Cap Semi  value 1uF  [C1206]
C30  Cap Semi  value 1uF  [C1206]
J1  Header 2  [PheonixContact_1757242]
J2  Header 3  [3_test_pin]
J5  Header 1  [GNDOUT]
J6  Header 2  [BatteryConnector_Molex_1720640002]
U24  AZ1117E  [SOT223]
VR1  L78series  [L78_TO220_3]

### Nets
3V3: C30.2 U24.2(VO) U24.4(VO)
9V: C25.2 J2.1 J6.1 VR1.1(VIN)
+5V: C26.2 C29.2 J2.3 U24.3(VIN) VR1.3(VOUT)
GND: C25.1 C26.1 C29.1 C30.1 J1.1 J2.2 J5.1 J6.2 U24.1(GND) VR1.2(GND)
V_IN: J1.2

### Notes on the sheet
- Connectors:
  J1 is for Vin input;
  J2 is for testing or connecting to benchtop PS for logic;
  J5 is to connect the GND of the DBD;
  J6 is to connect to logic batteries when on flight.

### Library data of the parts
C25 C26 C29 C30 = Cap Semi: Capacitor (Semiconductor SIM Model); Published: 8-Jun-2000; LatestRevisionDate: 29-May-2009; LatestRevisionNote: IPC-7351 Footprint Added.; PackageReference: C1206; Publisher: Altium Limited; PackageDescription: Chip Capacitor
J1 J6 = Header 2: Header, 2-Pin; LatestRevisionDate: 17-Jul-2002; LatestRevisionNote: Re-released for DXP Platform.; Publisher: Altium Limited
J2 = Header 3: Header, 3-Pin; LatestRevisionDate: 17-Jul-2002; LatestRevisionNote: Re-released for DXP Platform.; Publisher: Altium Limited
J5 = Header 1: Header, 1-Pin; LatestRevisionDate: 17-Jul-2002; LatestRevisionNote: Re-released for DXP Platform.; Publisher: Altium Limited
VR1 = PM-REG-L78: Positive Voltage Regulator; ComponentLink1Description: Manufacturer URL; PackageVersion: 2011; ComponentLink1URL: http://www.st.com; DatasheetVersion: 1/02/2011

## Nets that join several sheets
3V3: Snip_MCU (16 pins), Snip_Power (C30.2 U24.2 U24.4)
+5V: Snip_MCU (10 pins), Snip_SCMLI (15 pins), SCMLI/GM2 (11 pins), SCMLI/GM3 (11 pins), SCMLI/GM4 (11 pins), SCMLI/GM5 (11 pins), SCMLI/GM6 (11 pins), SCMLI/GM7 (11 pins), SCMLI/GM8 (11 pins), SCMLI/GM9 (11 pins), SCMLI/GM10 (11 pins), Snip_Power (5 pins)
GND: Snip_MCU (30 pins), Snip_SCMLI (23 pins), SCMLI/GM2 (11 pins), SCMLI/GM3 (11 pins), SCMLI/GM4 (11 pins), SCMLI/GM5 (11 pins), SCMLI/GM6 (11 pins), SCMLI/GM7 (11 pins), SCMLI/GM8 (11 pins), SCMLI/GM9 (11 pins), SCMLI/GM10 (11 pins), Snip_Power (10 pins)
V_IN: Snip_SCMLI (Cin.2 Q48.2), Snip_Power (J1.2)
IN: Snip_SCMLI (C12.2 D12.2 Q45.2), SCMLI/GM2 (Q8_GM2.2 Q11_GM2.2)
IN: SCMLI/GM2 (C8_GM2.2 D5_GM2.2 Q5_GM2.2), SCMLI/GM3 (Q8_GM3.2 Q11_GM3.2)
IN: SCMLI/GM3 (C8_GM3.2 D5_GM3.2 Q5_GM3.2), SCMLI/GM4 (Q8_GM4.2 Q11_GM4.2)
IN: SCMLI/GM4 (C8_GM4.2 D5_GM4.2 Q5_GM4.2), SCMLI/GM5 (Q8_GM5.2 Q11_GM5.2)
IN: SCMLI/GM5 (C8_GM5.2 D5_GM5.2 Q5_GM5.2), SCMLI/GM6 (Q8_GM6.2 Q11_GM6.2)
IN: SCMLI/GM6 (C8_GM6.2 D5_GM6.2 Q5_GM6.2), SCMLI/GM7 (Q8_GM7.2 Q11_GM7.2)
IN: SCMLI/GM7 (C8_GM7.2 D5_GM7.2 Q5_GM7.2), SCMLI/GM8 (Q8_GM8.2 Q11_GM8.2)
IN: SCMLI/GM8 (C8_GM8.2 D5_GM8.2 Q5_GM8.2), SCMLI/GM9 (Q8_GM9.2 Q11_GM9.2)
IN: SCMLI/GM9 (C8_GM9.2 D5_GM9.2 Q5_GM9.2), SCMLI/GM10 (Q8_GM10.2 Q11_GM10.2)
IN11: Snip_SCMLI (Q2.2), SCMLI/GM10 (C8_GM10.2 D5_GM10.2 Q5_GM10.2)
OUT_LOW: Snip_SCMLI (11 pins), SCMLI/GM10 (Q10_GM10.2)
OUT_LOW: SCMLI/GM2 (Q10_GM2.2), SCMLI/GM3 (7 pins)
OUT_LOW: SCMLI/GM3 (Q10_GM3.2), SCMLI/GM4 (7 pins)
OUT_LOW: SCMLI/GM4 (Q10_GM4.2), SCMLI/GM5 (7 pins)
OUT_LOW: SCMLI/GM5 (Q10_GM5.2), SCMLI/GM6 (7 pins)
OUT_LOW: SCMLI/GM6 (Q10_GM6.2), SCMLI/GM7 (7 pins)
OUT_LOW: SCMLI/GM7 (Q10_GM7.2), SCMLI/GM8 (7 pins)
OUT_LOW: SCMLI/GM8 (Q10_GM8.2), SCMLI/GM9 (7 pins)
OUT_LOW: SCMLI/GM9 (Q10_GM9.2), SCMLI/GM10 (7 pins)
REFB: Snip_SCMLI (Q49.2), SCMLI/GM2 (7 pins)
SW_A: Snip_MCU (Ur8.17), SCMLI/GM5 (R16_GM5.2)
SW_A: Snip_MCU (Ur8.22), SCMLI/GM6 (R16_GM6.2)
SW_A: Snip_MCU (Ur7.17), SCMLI/GM3 (R16_GM3.2)
SW_A: Snip_MCU (Ur7.22), SCMLI/GM4 (R16_GM4.2)
SW_A: Snip_MCU (Ur9.17), SCMLI/GM7 (R16_GM7.2)
SW_A: Snip_MCU (Ur9.22), SCMLI/GM8 (R16_GM8.2)
SW_A: Snip_MCU (Ur10.17), SCMLI/GM9 (R16_GM9.2)
SW_A: Snip_MCU (Ur10.22), SCMLI/GM10 (R16_GM10.2)
SW_A: Snip_MCU (Ur6.22), SCMLI/GM2 (R16_GM2.2)
SW_A1: Snip_MCU (Ur6.17), Snip_SCMLI (Rr4.2)
SW_B: Snip_MCU (Ur8.14), SCMLI/GM5 (R17_GM5.2)
SW_B: Snip_MCU (Ur8.19), SCMLI/GM6 (R17_GM6.2)
SW_B: Snip_MCU (Ur7.14), SCMLI/GM3 (R17_GM3.2)
SW_B: Snip_MCU (Ur7.19), SCMLI/GM4 (R17_GM4.2)
SW_B: Snip_MCU (Ur9.14), SCMLI/GM7 (R17_GM7.2)
SW_B: Snip_MCU (Ur9.19), SCMLI/GM8 (R17_GM8.2)
SW_B: Snip_MCU (Ur10.14), SCMLI/GM9 (R17_GM9.2)
SW_B: Snip_MCU (Ur10.19), SCMLI/GM10 (R17_GM10.2)
SW_B: Snip_MCU (Ur6.19), SCMLI/GM2 (R17_GM2.2)
SW_B11: Snip_MCU (Ur10.23), Snip_SCMLI (R98.2)
SW_C: Snip_MCU (Ur8.18), SCMLI/GM6 (R18_GM6.1)
SW_C: Snip_MCU (Ur8.23), SCMLI/GM7 (R18_GM7.1)
SW_C: Snip_MCU (Ur7.18), SCMLI/GM4 (R18_GM4.1)
SW_C: Snip_MCU (Ur7.23), SCMLI/GM5 (R18_GM5.1)
SW_C: Snip_MCU (Ur9.18), SCMLI/GM8 (R18_GM8.1)
SW_C: Snip_MCU (Ur9.23), SCMLI/GM9 (R18_GM9.1)
SW_C: Snip_MCU (Ur10.18), SCMLI/GM10 (R18_GM10.1)
SW_C: Snip_MCU (Ur6.18), SCMLI/GM2 (R18_GM2.1)
SW_C: Snip_MCU (Ur6.23), SCMLI/GM3 (R18_GM3.1)
SW_C1: Snip_MCU (Ur6.14), Snip_SCMLI (U14.4)
SW_D: Snip_MCU (Ur8.16), SCMLI/GM5 (R19_GM5.2)
SW_D: Snip_MCU (Ur8.21), SCMLI/GM6 (R19_GM6.2)
SW_D: Snip_MCU (Ur7.16), SCMLI/GM3 (R19_GM3.2)
SW_D: Snip_MCU (Ur7.21), SCMLI/GM4 (R19_GM4.2)
SW_D: Snip_MCU (Ur9.16), SCMLI/GM7 (R19_GM7.2)
SW_D: Snip_MCU (Ur9.21), SCMLI/GM8 (R19_GM8.2)
SW_D: Snip_MCU (Ur10.16), SCMLI/GM9 (R19_GM9.2)
SW_D: Snip_MCU (Ur10.21), SCMLI/GM10 (R19_GM10.2)
SW_D: Snip_MCU (Ur6.21), SCMLI/GM2 (R19_GM2.2)
SW_D1: Snip_MCU (Ur6.16), Snip_SCMLI (R2.2)
SW_E: Snip_MCU (Ur8.15), SCMLI/GM5 (R20_GM5.2)
SW_E: Snip_MCU (Ur8.20), SCMLI/GM6 (R20_GM6.2)
SW_E: Snip_MCU (Ur7.15), SCMLI/GM3 (R20_GM3.2)
SW_E: Snip_MCU (Ur7.20), SCMLI/GM4 (R20_GM4.2)
SW_E: Snip_MCU (Ur9.15), SCMLI/GM7 (R20_GM7.2)
SW_E: Snip_MCU (Ur9.20), SCMLI/GM8 (R20_GM8.2)
SW_E: Snip_MCU (Ur10.15), SCMLI/GM9 (R20_GM9.2)
SW_E: Snip_MCU (Ur10.20), SCMLI/GM10 (R20_GM10.2)
SW_E: Snip_MCU (Ur6.20), SCMLI/GM2 (R20_GM2.2)
SW_E1: Snip_MCU (Ur6.15), Snip_SCMLI (R4.2)